# Altium schematic sheet PG02_ Block Diagram.SchDoc
size 420 x 297 mm
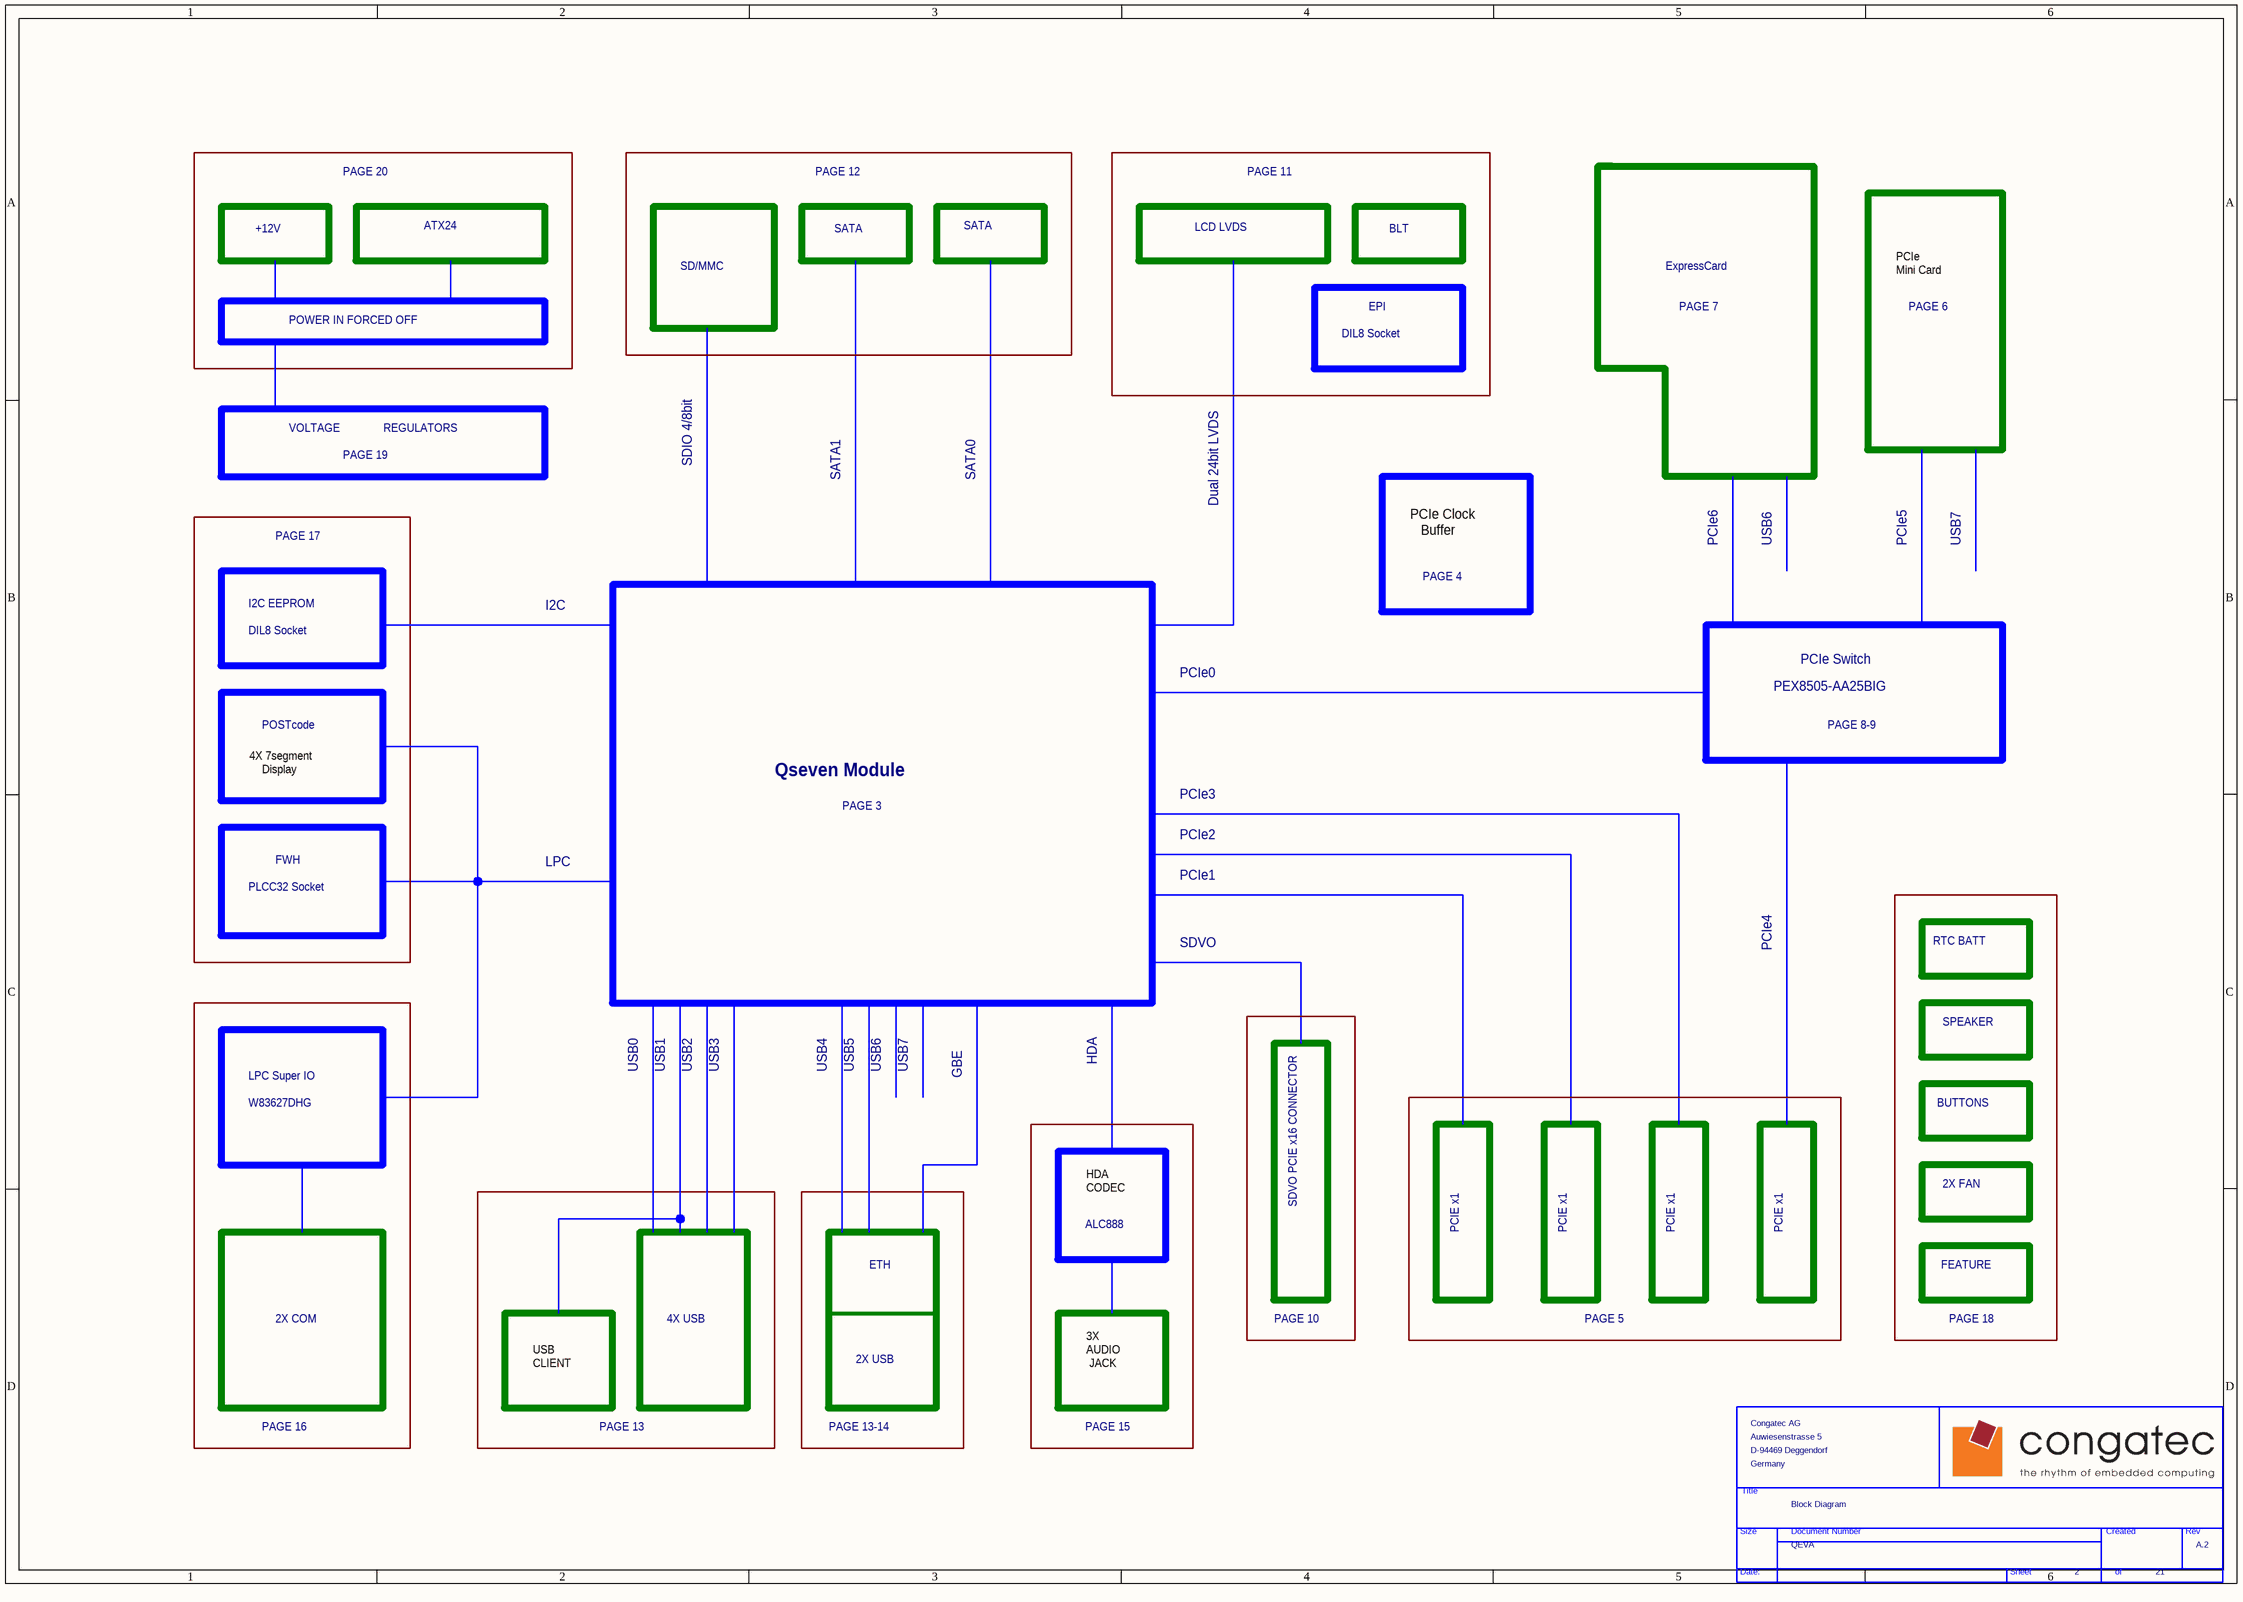
[diagram p0: PG02_ Block Diagram.SchDoc]

## Parts
*  Page Count: 21  Page Number: 2  Title: Block Diagram  RevCode: A.2  Doc: QEVA  OrgName: Congatec AG  OrgAddr1: Auwiesenstrasse 5  OrgAddr2: D-94469 Deggendorf  OrgAddr3: Germany  (hidden comment: TitleBlock_CONGA)  (graphical)

## Notes on the sheet
- PAGE 20
- PAGE 12
- PAGE 11
- +12V
- ATX24
- SATA
- LCD LVDS
- BLT
- POWER IN FORCED OFF
- SD/MMC
- EPI
- ExpressCard
- PAGE 7
- PCIe
  Mini Card
- PAGE 6
- DIL8 Socket
- VOLTAGE
- PAGE 19
- REGULATORS
- SDIO 4/8bit
- SATA1
- SATA0
- Dual 24bit LVDS
- PAGE 17
- PCIe Clock
  Buffer
- PAGE 4
- PCIe6
- USB6
- PCIe5
- USB7
- I2C EEPROM
- I2C
- PCIe Switch
- POSTcode
- PCIe0
- PEX8505-AA25BIG
- PAGE 8-9
- 4X 7segment
  Display
- Qseven Module
- PCIe3
- FWH
- LPC
- PAGE 3
- PCIe2
- PLCC32 Socket
- PCIe1
- SDVO
- PCIe4
- RTC BATT
- USB0
- USB1
- USB2
- USB3
- USB4
- USB5
- HDA
- SPEAKER
- LPC Super IO
- W83627DHG
- GBE
- BUTTONS
- HDA
  CODEC
- SDVO PCIE x16 CONNECTOR
- 2X FAN
- ETH
- ALC888
- PCIE x1
- FEATURE
- 2X COM
- 4X USB
- PAGE 10
- PAGE 5
- PAGE 18
- USB
  CLIENT
- 2X USB
- 3X
  AUDIO
  JACK
- PAGE 16
- PAGE 13
- PAGE 13-14
- PAGE 15
- (in symbol TitleBlock_CONGA) Title; Size; Document Number; Created; Rev; Date:; Sheet; of

## Library data of the parts
* = TitleBlock_CONGA: Page Create Date: March  8, 1995